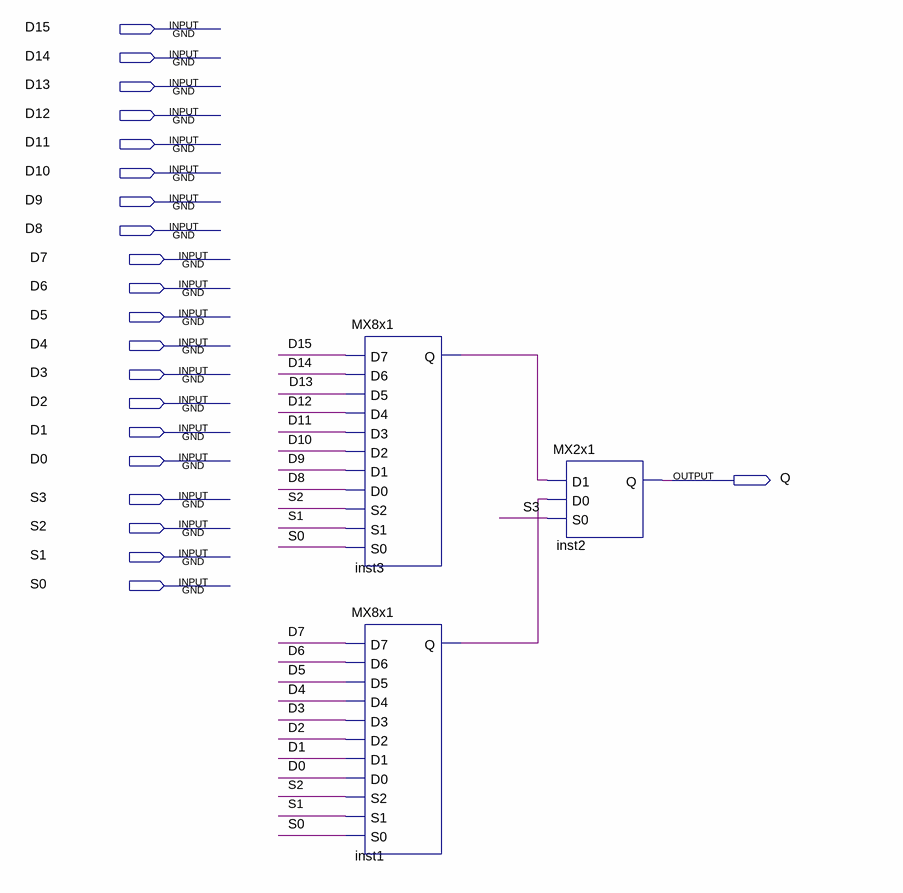
[diagram p0: schematic sheet]
// Quartus schematic MX16x1.bdf as structural Verilog: 3 symbols, 21 pins
module MX16x1 (
  input  D15,
  input  D14,
  input  D13,
  input  D12,
  input  D11,
  input  D10,
  input  D9,
  input  D8,
  input  D7,
  input  D6,
  input  D5,
  input  D4,
  input  D3,
  input  D2,
  input  D1,
  input  D0,
  input  S3,
  input  S2,
  input  S1,
  input  S0,
  output Q
);

  wire inst1_q, inst3_q;

  MX8x1 inst3 (
    .D7(D15), .D6(D14), .D5(D13), .D4(D12), .D3(D11), .D2(D10), .D1(D9), .D0(D8), .S2(S2), .S1(S1), .S0(S0),
    .Q(inst3_q));
  MX8x1 inst1 (
    .D7(D7), .D6(D6), .D5(D5), .D4(D4), .D3(D3), .D2(D2), .D1(D1), .D0(D0), .S2(S2), .S1(S1), .S0(S0),
    .Q(inst1_q));
  MX2x1 inst2 (.D1(inst3_q), .D0(inst1_q), .S0(S3), .Q(Q));
endmodule
